# Altium schematic sheet S_dktriac.SchDoc
size A
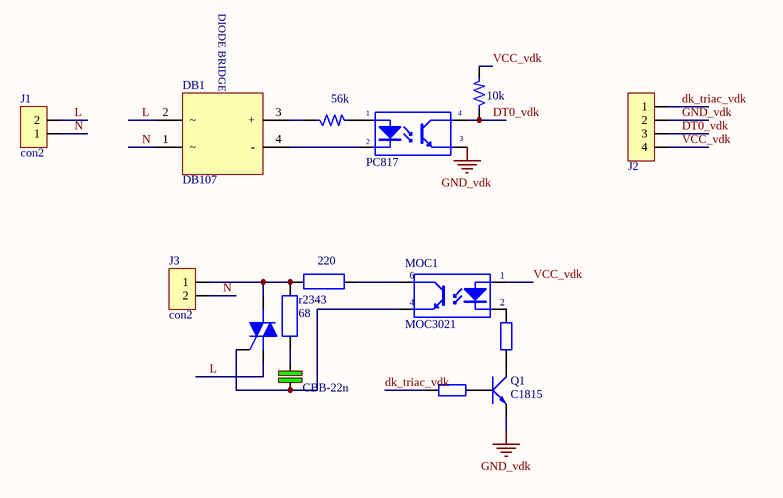
[diagram p0: S_dktriac.SchDoc]

## Parts
C123  CBB-22n  [CAP_MICA_10MM]
DB1  DB107  [DB107]
J1  con2  [Con2]
J2  Jum4x1_2.54  [Jum4Ð_2.54]  (value not drawn)
J3  con2  [Con2]
MOC1  MOC3021  [DIP6]
OP1  PC817  [PC817-dip]
Q1  C1815  [SOT23-321]
R1  10k  [0805]
R2  56k  [0805]
R3  220  [RES_SMD_0805]
R4  1k  [DIEN TRO 0805]  (value not drawn)
R5  1k  [DIEN TRO 0805]  (value not drawn)
r2343  68  [R1W]
TR1  BTA12-600  [BTA6-600]  (value not drawn)

## Nets
GND_vdk: J2.2 OP1.3(E) Q1.1(E)
dk_triac_vdk: J2.1 R5.2
DT0_vdk: J2.3 OP1.4(C) R1.1
L: DB1.2 J1.2 TR1.1(M1)
N: DB1.1 J1.1 J3.2
VCC_vdk: J2.4 MOC1.1(A) R1.2
NetC123_1: C123.1 MOC1.4(E) TR1.3(G)
NetC123_2: C123.2 r2343.1
NetDB1_3: DB1.3(+) R2.1
NetDB1_4: DB1.4(-) OP1.2(K)
NetJ3_1: J3.1 R3.1 r2343.2 TR1.2(M2)
NetMOC1_2: MOC1.2(K) R4.2
NetMOC1_6: MOC1.6(C) R3.2
NetOP1_1: OP1.1(A) R2.2
NetQ1_2: Q1.2(C) R4.1
NetQ1_3: Q1.3(B) R5.1

## Notes on the sheet
- (in symbol DB107) DIODE BRIDGE

## Library data of the parts
C123 = CAP: Cap np  1pF - 472pF; Value: 100pF
MOC1 = MOC3021_1: Single Opto; Value: MOC3021
Q1 = C1815: NPN 600mW, ECB; Value: C1815
R1 R2 = res_0805
R3 r2343 = R1W: Resistor 1W; Value: R1W - 100
R4 R5 = R0805: Resistor SMD 0805; Published: 8-Jun-2000; LatestRevisionDate: 17-Jul-2002; LatestRevisionNote: Re-released for DXP Platform.; PackageReference: AXIAL-0.4; Publisher: Altium Limited
TR1 = BTA12-600: Silicon Bidirectional Triode Thyristor; Note: Pin 2 is electrically connected to Pin 4 (TAB); Published: 29-Sep-2000; LatestRevisionDate: 17-Jul-2002; LatestRevisionNote: Re-released for DXP Platform.; DatasheetDocument: 1999; PackageReference: 369-03; Publisher: Altium Limited; Code_JEDEC: TO-251-AA; ComponentLink1Description: Manufacturer Link; ComponentLink1URL: http://www.motorola.com/